# Altium schematic sheet ISO_INPUT.SchDoc
size 381 x 241 mm; SheetNumber: 2; SheetTotal: 7
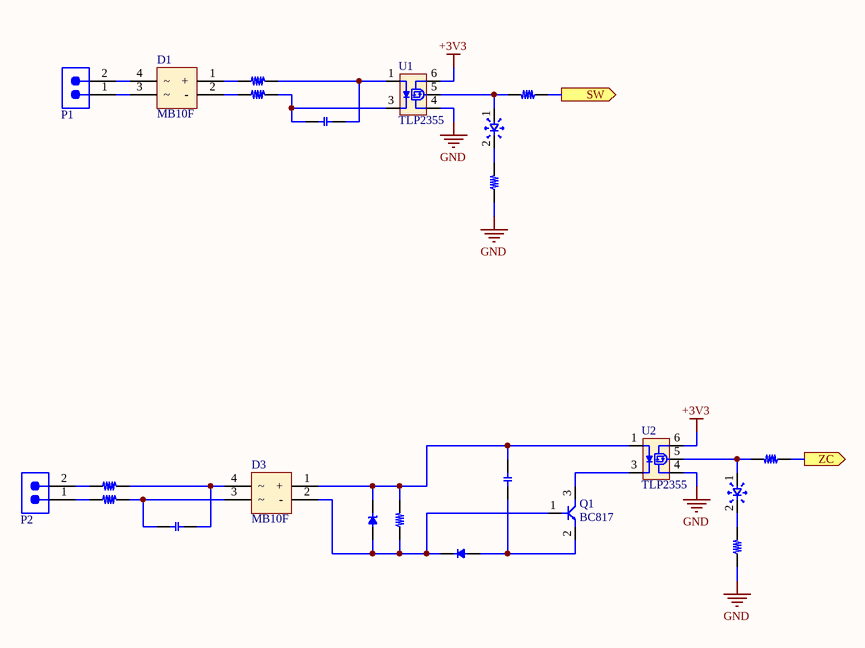
[diagram p0: ISO_INPUT.SchDoc]

## Parts
C1  CAP_SMD  [C 1206]  (value not drawn)
C2  CAP_SMD  [C 1206]  (value not drawn)
C3  CAP_SMD  [C 1206]  (value not drawn)
D1  MB10F  [MBF]
D2  LED_SMD  [D 0603]  (value not drawn)
D3  MB10F  [MBF]
D4  LED_SMD  [D 0603]  (value not drawn)
D5  DIOD_SMD_ZENER  [DIOD_SMA]  (value not drawn)
D6  DIOD_SMD  [DIOD_SMA]  (value not drawn)
P1  691321300002  [691321300002]  (value not drawn)
P2  691321300002  [691321300002]  (value not drawn)
Q1  BC817  [SOT-23_3_Q]
R1  RES_SMD  [R 1206]  (value not drawn)
R2  RES_SMD  [R 1206]  (value not drawn)
R3  RES_SMD  [R 0603]  (value not drawn)
R4  RES_SMD  [R 0603]  (value not drawn)
R5  RES_SMD  [R 0603]  (value not drawn)
R6  RES_SMD  [R 1206]  (value not drawn)
R7  RES_SMD  [R 1206]  (value not drawn)
R8  RES_SMD  [R 1206]  (value not drawn)
R9  RES_SMD  [R 0603]  (value not drawn)
U1  TLP2355  [SOIC-6-5]
U2  TLP2355  [SOIC-6-5]

## Ports
SW (out), ZC (out)

## Nets
+3V3: U1.6(VCC) U2.6(VCC)
GND: R4.1 R9.1 U1.4(GND) U2.4(GND)
SW: R3.1 ; port SW
ZC: R5.1 ; port ZC
NetC1_1: C1.1 R2.2 U1.3(K)
NetC1_2: C1.2 R1.2 U1.1(A)
NetC2_1: C2.1 D3.1(+) D5.2 R8.2 U2.1(A)
NetC2_2: C2.2 D6.1 Q1.2(E)
NetC3_1: C3.1 D3.3 R7.2
NetC3_2: C3.2 D3.4 R6.2
NetD1_1: D1.1(+) R1.1
NetD1_2: D1.2(-) R2.1
NetD1_3: D1.3 P1.1
NetD1_4: D1.4 P1.2
NetD2_1: D2.1 R3.2 U1.5(OUT)
NetD2_2: D2.2 R4.2
NetD3_2: D3.2(-) D5.1 D6.2 Q1.1(B) R8.1
NetD4_1: D4.1 R5.2 U2.5(OUT)
NetD4_2: D4.2 R9.2
NetP2_1: P2.1 R7.1
NetP2_2: P2.2 R6.1
NetQ1_3: Q1.3(C) U2.3(K)

## Library data of the parts
P1 P2 = 691321300002: WR-TBL Series 321 Vertical PCB Header, Through Hole, pitch 3.81mm, 2p; Manufacturer: Wurth Elektronik; Pin Number: 2; Rated Current: 10A; Working Voltage: 300V; Modularity: No; ComponentLink1Description: Manufacturer Link; ComponentLink1URL: https://www.we-online.com/redexpert/article/691321300002?ad; ComponentLink2Description: Datasheet; ComponentLink2URL: https://www.we-online.com/redexpert/spec/691321300002?ad; Category: Terminal Blocks; Match Code: WR-TBL; Manufacturer Part Number: 691321300002; Mount: Through Hole; Operating Temperature Max: 105°C; Operating Temperature Min: -40°C; Packaging: Box; Pitch: 3.81mm; Orientation: Vertical; Application: Pluggable; PCB/Cable/Panel: PCB